# Altium schematic sheet Sheet_RES_MEAS.SchDoc
size A4; SheetNumber: 6; SheetTotal: 7
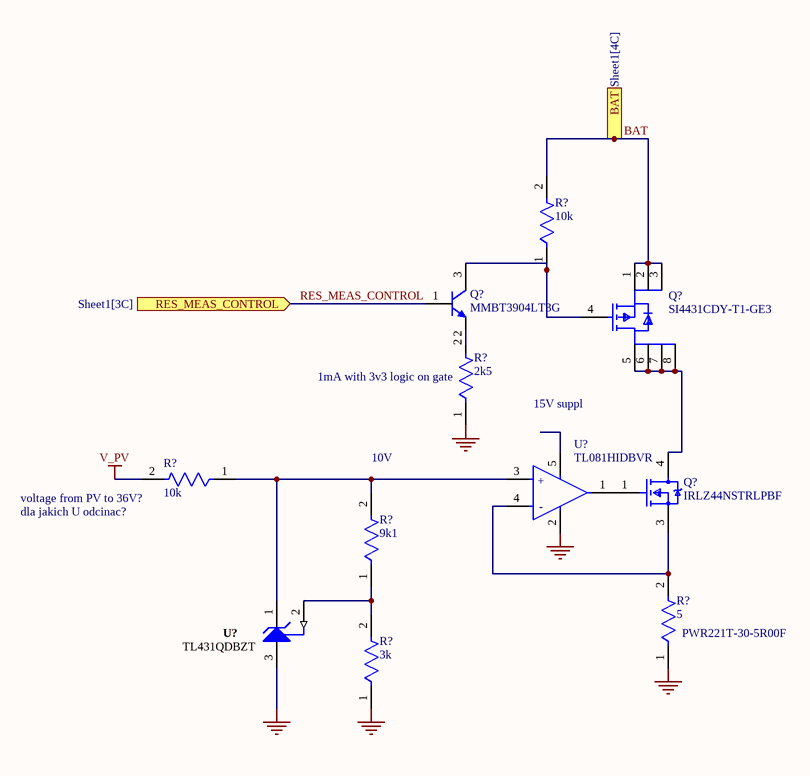
[diagram p0: Sheet_RES_MEAS.SchDoc]

## Parts
(Parts that share a designator on the sheet are numbered #1, #2 ... from top to bottom, then left to right.)
Q?#1  MMBT3904LT3G  [ONSC-SOT-23-3-318-08_V]
Q?#2  SI4431CDY-T1-GE3  [FP-C-06527-MFG]
Q?#3  IRLZ44NSTRLPBF  [FP-PG-TO263-3-MFG]
R?#1  10k  [FP-RT0805-MFG]
R?#2  2k5  [FP-AC0805-MFG]
R?#3  10k  [FP-RT0805-MFG]
R?#4  9k1  [FP-RN73R2A-IPC_C]
R?#5  5  [FP-PWR220T-20-MFG]
R?#6  3k  [FP-RN73R1E-IPC_A]
U?#1  TL081HIDBVR  [FP-DBV0005A-MFG]
U?#2  TL431QDBZT  [DBZ0003A_L]

## Ports
BAT (in, see Sheet1[4C]), RES_MEAS_CONTROL (in, see Sheet1[3C])

## Nets
GND: R?#2.1 R?#5.1 R?#6.1 U?#1.2(V-) U?#2.3(ANODE)
V_PV: R?#3.2
BAT: Q?#2.1(S) Q?#2.2(S) Q?#2.3(S) R?#1.2 ; port BAT
RES_MEAS_CONTROL: Q?#1.1(B) ; port RES_MEAS_CONTROL
NetQ?#1_2: Q?#1.2(E) R?#2.2
NetQ?#1_3: Q?#1.3(C) Q?#2.4(G) R?#1.1
NetQ?#2_5: Q?#2.5(D) Q?#2.6(D) Q?#2.7(D) Q?#2.8(D) Q?#3.4(D)
NetQ?#3_1: Q?#3.1(G) U?#1.1(OUT)
NetQ?#3_3: Q?#3.3(S) R?#5.2 U?#1.4(IN-)
NetR?#3_1: R?#3.1 R?#4.2 U?#1.3(IN+) U?#2.1(CATHODE)
NetR?#4_1: R?#4.1 R?#6.2 U?#2.2(REF)

Not connected (* = marked no-connect by the designer): U?#1 5(V+)

## Notes on the sheet
- (near R?#2) 1mA with 3v3 logic on gate
- 15V suppl
- 10V
- (near R?#3) voltage from PV to 36V?
- (near R?#3) dla jakich U odcinac?
- (near R?#5) PWR221T-30-5R00F
- (in symbol CMP-00370-120332668-1) +; -

## Library data of the parts
Q?#1 = CMP-1048-00630-1: General Purpose Transistor, NPN Silicon, 3-Pin SOT-23, Pb-Free, Tape and Reel; Manufacturer: On Semiconductor; fT Min (MHz): 300; IC Continuous (A): 0.2; PackageVersion: Rev. AP, 11/2009; PackageReference: SOT-23-3-318-08; Packing: Tape and Reel; RoHS: TRUE; ComponentLink2Description: Datasheet; PackageDescription: 3-Pin Small Outline Transistor, Body 2.92 x 1.3 mm, Pitch 0.95 mm; PartNumber: MMBT3904LT3G; ComponentLink1Description: Manufacturer URL; ComponentLink3URL: http://www.onsemi.cn/pub_link/Collateral/318-08.PDF; Mounting Technology: Surface Mount; ComponentLink3Description: Package Specification; DatasheetVersion: Rev. 12; ComponentLink1URL: http://www.onsemi.com/; ComponentLink2URL: http://www.onsemi.cn/pub_link/Collateral/MMBT3904LT1-D.PDF; Polarity: NPN
Q?#2 = CMP-02550-000031-1: MOSFET P-CH 30V 9A 8-SOIC; Manufacturer: Vishay; Turn Off Delay Time: 23ns; Max Forward Diode Voltage: -1.2V; Drain To Source Breakdown Voltage: -30V; Number Of P Channels: 1; Standoff Height: 0.1mm; Continuous Drain Current: -7A; Gate To Source Voltage: 20V; Threshold Vgs Min: -1V; Gate Charge At Vgs: 25nC @ -10V; Turn On Delay Time: 10ns; Typ Forward Diode Voltage: -0.71V; Input Capacitace At Vds: 1006pF @ -15V; Reverse Recovery Time: 22ns; Transconductance: 18S; Reverse Recovery Charge: 17nC; Pulse Drain Current: -30A; Threshold Vgs Max: -2.5V; Drain To Source Resistance: 0.026Ω; Power Dissipation: 2.5W; Depletion Mode: False; Rthja Max: 40°C/W; Max Junction Temp: +150°C; Mouser Description: MOSFET 30V 9.0A 4.2W 32mohm @ 10V; Digikey Description: MOSFET P-CH 30V 9A 8-SOIC; Height: 1.75mm; Package: C-06527; Device Class L3: MOSFETs; Temperature Range Low: -55°C; Number Of Channels: 1; Automotive: No; Temperature: -55°C to +150°C; Device Class L2: Transistors; Manufacturer Part Number: SI4431CDY-T1-GE3; Device Class L1: Discrete Semiconductors; Ipc Land Pattern Name: SOIC127P600X155-8; Drain To Source Voltage: -30V; Temperature Range High: +150°C; ComponentLink2URL: http://www.vishay.com/docs/68748/si4431cd.pdf; ComponentLink2Description: Datasheet; Lead Free: Yes; RoHS: TRUE; Octopart: https://octopart.com/si4431cdy-t1-ge3-vishay-44648921; Category: Trans
Q?#3 = CMP-32901-000495-1: MOSFET N-CH 55V 47A D2PAK; Rds On Max: 22mR; Input Capacitance: 1.7nF; Turn-On Delay Time: 11ns; Turn-Off Delay Time: 26ns; Power Dissipation: 110W; Element Configuration: Single; Gate to Source Voltage (Vgs): 16V; Drain to Source Resistance: 35mR; Threshold Voltage: 2V; Max Power Dissipation: 3.8W; Lead Free: Contains Lead; Max Dual Supply Voltage: 55V; Width: 0.38inch; Mount: Surface Mount; Continuous Drain Current (ID): 47A; Min Operating Temperature: -55°C; Number of Pins: 3; REACH SVHC: No SVHC; Height: 0.19inch; Length: 0.42inch; Case/Package: D2PAK; Drain to Source Breakdown Voltage: 55V; Packaging: Tape and Reel; Drain to Source Voltage (Vdss): 55V; Halogen Free: Halogen Free; RoHS Compliant: Yes; Max Operating Temperature: 175°C
R?#1 R?#3 = CMP-03412-013123-1: RES SMD 10K OHM 0.25% 1/8W 0805; Manufacturer Part Number: RT0805CRD0710KL; Manufacturer: Yageo; Value: 10KΩ; Voltage Rating: 150V; Tolerance: 0.005; Power Rating: 0.125W; Temperature Coefficient: 25 ppm/°C; Composition: Thin Film; Device Class L3: Chip SMD Resistors; Automotive: No; ComponentLink2Description: Datasheet; RoHS: TRUE; Temperature Range Low: -55°C; Footprint Url: http://www.yageo.com/exep/pages/download/literatures/PYu-R_Mount_10.pdf; Temperature Range High: +155°C; Digikey Description: RES SMD 10K OHM 0.25% 1/8W 0805; ComponentLink2URL: http://www.yageo.com/documents/recent/PYu-RT_1-to-0.01_RoHS_L_9.pdf; Octopart: https://octopart.com/rt0805crd0710kl-yageo-1253059; Device Class L2: Resistors; Lead Free: Yes; Height: 0.6mm; Temperature: -55°C to +155°C; Resistance: 10KΩ; Series: RT; Ipc Land Pattern Name: RESC200125X50; Category: Res; Device Class L1: Passive Components; Package: RT0805
R?#2 = CMP-03412-037614-1: RES SMD 2.2K OHM 5% 1/8W 0805; Manufacturer Part Number: AC0805JR-072K2L; Manufacturer: Yageo; Voltage Rating: 150V; Value: 2.2KΩ; Automotive Grade: Grade 0; Tolerance: 0.05; RoHS: TRUE; Automotive: Yes; Temperature: -55°C to +155°C; Power Rating: 1/8W; Height: 0.6mm; ComponentLink2Description: Datasheet; Temperature Range Low: -55°C; Device Class L1: Passive Components; Package: AC0805; Composition: Thick Film; Device Class L2: Resistors; Ipc Land Pattern Name: RESC200125X50; Lead Free: Yes; Resistance: 2.2KΩ; ComponentLink2URL: http://www.yageo.com/documents/recent/PYu-AC_51_RoHS_L_6.pdf; Mouser Description: Thick Film Resistors - SMD 1/8W 2.2K ohm 5% AEC-Q200; Series: AC; Category: Res; Footprint Url: http://www.yageo.com/exep/pages/download/literatures/PYu-R_Mount_10.pdf; Octopart: https://octopart.com/ac0805jr-072k2l-yageo-30510982; Digikey Description: RES SMD 2.2K OHM 5% 1/8W 0805; Device Class L3: Chip SMD Resistors; Temperature Range High: +155°C
R?#4 = CMP-04015-024559-1: 9.1kΩ ±0.1% 0.125W, 1/8W Chip Resistor 0805 (2012 Metric) Moisture Resistant Thin Film
R?#5 = CMP-07232-000002-1: RES 5 OHM 20W 5% TO220; Manufacturer Part Number: PWR220T-20-5R00J; Manufacturer: Bourns; Temperature Coefficient: 100ppm/°C; Resistance: 5Ω; Automotive Grade: Grade 0; Value: 5Ω; Voltage Rating: 250V; Composition: Thick Film; Tolerance: 5%; Power Rating: 20W; Digikey Description: RES 5 OHM 20W 5% TO220; Octopart: https://octopart.com/pwr220t-20-5r00j-bourns-21273404; Category: Res; Height: 14.98mm; Temperature Range High: +155°C; Device Class L3: Through-Hole Resistors; Series: PWR220T-20; ComponentLink2Description: Datasheet; ComponentLink2URL: https://www.bourns.com/docs/product-datasheets/pwr220t-20.pdf?sfvrsn=85de74b5_4; Mouser Description: Thick Film Resistors POWER RESISTOR 5%; Lead Free: Yes; Temperature: -55°C to +155°C; Package: PWR220T-20; RoHS: TRUE; Temperature Range Low: -55°C; Device Class L2: Resistors; Device Class L1: Passive Components; Automotive: Yes
R?#6 = CMP-04015-017594-1: 3kΩ ±1% 0.063W, 1/16W Chip Resistor 0402 (1005 Metric) Moisture Resistant Thin Film
U?#1 = CMP-00370-120332668-1: Operational Amplifier, 1 Func, 4000uV Offset-Max, BIPolar, PDSO5; Manufacturer Lifecycle Status: ACTIVE; Thickness: 1.2mm; Case/Package: SOT-23; Length: 2.9mm; Schedule B: 8542330000; Lifecycle Status: Production; Number of Pins: 5; Width: 1.6mm; Height: 1.45mm
U?#2 = CMP-0366-01046-2: Adjustable Precision Shunt Regulator, 34 ppm / degC, 100 mA, -40 to 125 degC, 3-pin SOT-23 (DBZ), Green (RoHS & no Sb/Br); Manufacturer: Texas Instruments; Temp Coeff(Typ)(ppm/ degree C): 34; VO Adj(Max)(V): 36; Min Iz for Regulation(uA): 600; VO Adj(Min)(V): 2.495; Rating: Military; SubFamily: Shunt Voltage Reference; Iout/Iz(Max)(mA): 100; Temp Coeff(Max)(ppm/ degree C): 92; Initial Accuracy @ 25/deg C(%): 2; ComponentLink2URL: http://www.ti.com/general/docs/lit/getliterature.tsp?genericPartNumber=TL431&fileType=pdf; Code_JEDEC: TO-236; PackageDescription: 3-Pin Plastic Small Outline, Body 2.92 x 1.3 mm, Pitch 0.95 mm; ComponentLink3Description: Package Specification; Mounting Technology: Surface Mount; PartNumber: TL431QDBZT; PackageVersion: 4203227/B; DatasheetVersion: SLVS543M; ComponentLink1Description: Manufacturer URL; Eco-Plan: Green (RoHS & no Sb/Br); PackageReference: DBZ0003A; ComponentLink3URL: http://www.ti.com/litv/pdf/mpds108a; ComponentLink1URL: http://www.ti.com/; ComponentLink2Description: Datasheet